# Altium project Pick and place Robot.PrjPcb
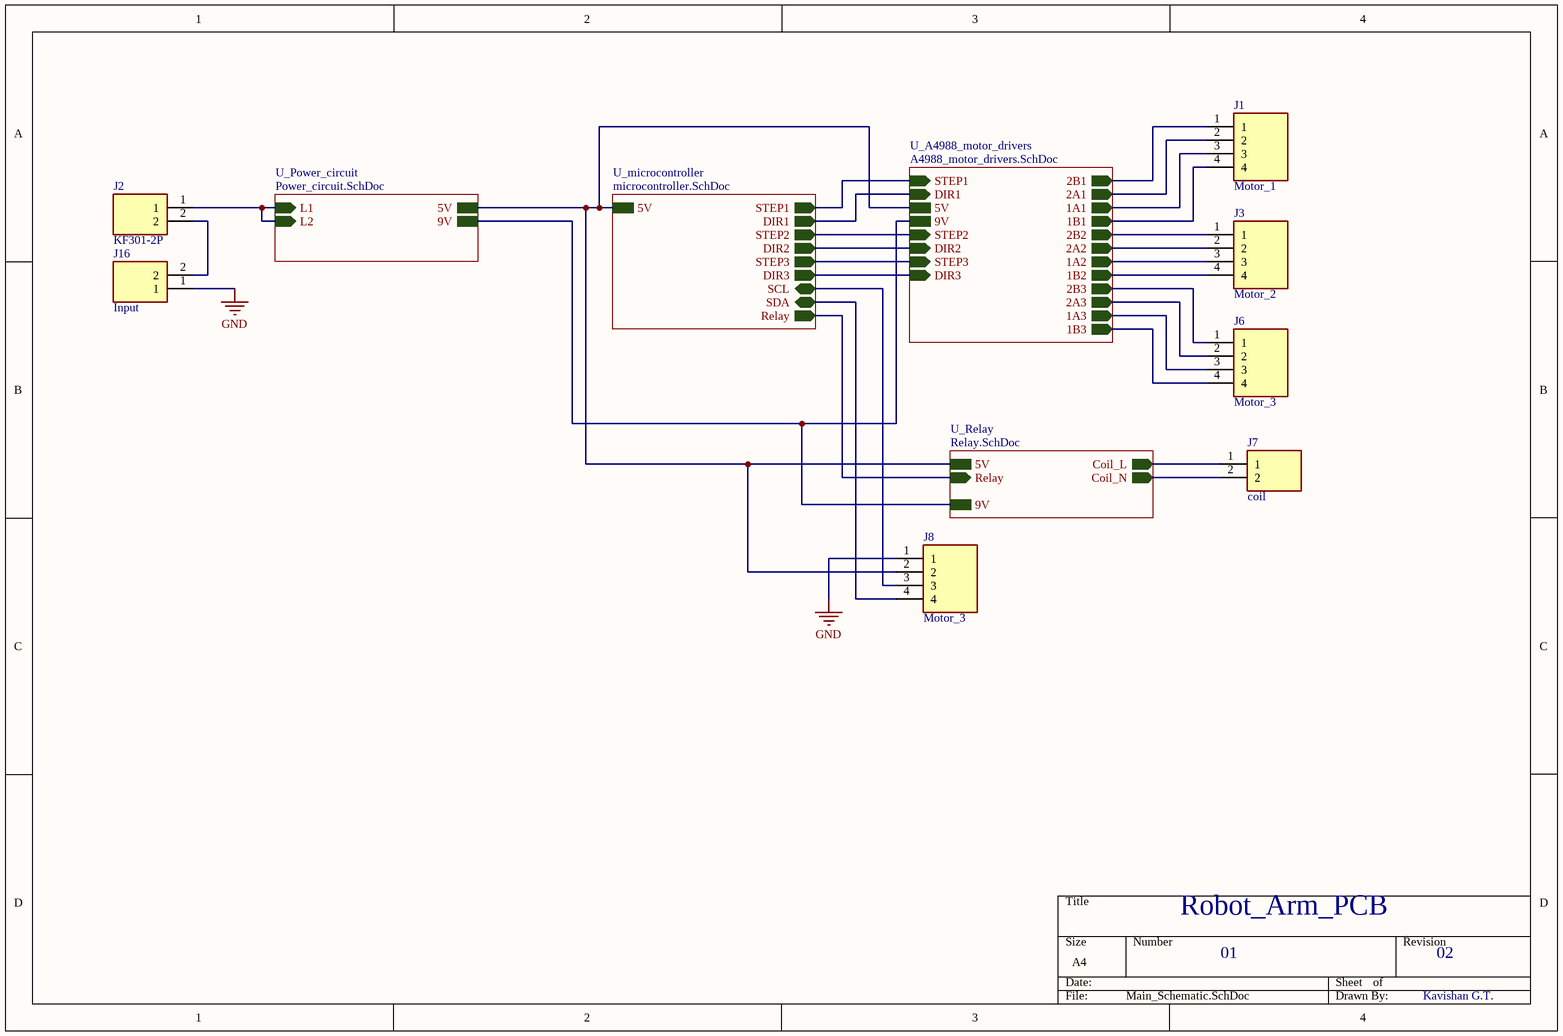
[diagram p0: Main_Schematic.SchDoc]
5 sheets, 45 parts. Net scope: hierarchical (ports join the sheet entries above them; power ports are global).
Board file: Main_pcb.PcbDoc
Sheets:
  Main_Schematic.SchDoc
    U_microcontroller = microcontroller.SchDoc
    U_A4988_motor_drivers = A4988_motor_drivers.SchDoc
    U_Relay = Relay.SchDoc
    U_Power_circuit = Power_circuit.SchDoc

## Sheet Main_Schematic.SchDoc
size A4; SheetNumber: 1; SheetTotal: 5

### Parts
J1  Motor_1  [SHDRRA4W64P0X250_1X4_1240X1150X700P]
J2  KF301-2P  [KF3012P]
J3  Motor_2  [SHDRRA4W64P0X250_1X4_1240X1150X700P]
J6  Motor_3  [SHDRRA4W64P0X250_1X4_1240X1150X700P]
J7  coil  [SHDR2W64P0X250_1X2_750X380X600P]
J8  Motor_3  [SHDRRA4W64P0X250_1X4_1240X1150X700P]
J16  Input  [SHDR2W64P0X250_1X2_750X380X600P]

### Sub-sheets
U_A4988_motor_drivers = A4988_motor_drivers.SchDoc: STEP1 (in), DIR1 (in), 2B1 (out), 2A1 (out), 1A1 (out), 1B1 (out), STEP2 (in), DIR2 (in), 2B2 (out), 2A2 (out), 1A2 (out), 1B2 (out), STEP3 (in), DIR3 (in), 2B3 (out), 2A3 (out), 1A3 (out), 1B3 (out), 5V, 9V
U_microcontroller = microcontroller.SchDoc: 5V, STEP1 (out), DIR1 (out), STEP2 (out), DIR2 (out), STEP3 (out), DIR3 (out), SCL (bidir), SDA (bidir), Relay (out)
U_Power_circuit = Power_circuit.SchDoc: L1 (in), 5V, L2 (in), 9V
U_Relay = Relay.SchDoc: Relay (in), Coil_L (out), Coil_N (out), 5V, 9V

### Nets
5V: J8.2 ; sheet U_microcontroller/5V, sheet U_A4988_motor_drivers/5V, sheet U_Relay/5V, sheet U_Power_circuit/5V
9V: J7.1 ; sheet U_A4988_motor_drivers/9V, sheet U_Relay/Coil_L, sheet U_Relay/9V, sheet U_Power_circuit/9V
GND: J8.1 J16.1
NetC1_1: J2.1 ; sheet U_Power_circuit/L1, sheet U_Power_circuit/L2
NetJ1_1: J1.1 ; sheet U_A4988_motor_drivers/2B1
NetJ1_2: J1.2 ; sheet U_A4988_motor_drivers/2A1
NetJ1_3: J1.3 ; sheet U_A4988_motor_drivers/1A1
NetJ1_4: J1.4 ; sheet U_A4988_motor_drivers/1B1
NetJ2_2: J2.2 J16.2
NetJ3_1: J3.1 ; sheet U_A4988_motor_drivers/2B2
NetJ3_2: J3.2 ; sheet U_A4988_motor_drivers/2A2
NetJ3_3: J3.3 ; sheet U_A4988_motor_drivers/1A2
NetJ3_4: J3.4 ; sheet U_A4988_motor_drivers/1B2
NetJ6_1: J6.1 ; sheet U_A4988_motor_drivers/2B3
NetJ6_2: J6.2 ; sheet U_A4988_motor_drivers/2A3
NetJ6_3: J6.3 ; sheet U_A4988_motor_drivers/1A3
NetJ6_4: J6.4 ; sheet U_A4988_motor_drivers/1B3
NetJ7_2: J7.2 ; sheet U_Relay/Coil_N
NetJ8_3: J8.3 ; sheet U_microcontroller/SCL
NetJ8_4: J8.4 ; sheet U_microcontroller/SDA
NetR3_1: sheet U_microcontroller/Relay, sheet U_Relay/Relay
NetU1_2: sheet U_microcontroller/STEP1, sheet U_A4988_motor_drivers/STEP1
NetU1_3: sheet U_microcontroller/DIR1, sheet U_A4988_motor_drivers/DIR1
NetU1_4: sheet U_microcontroller/STEP2, sheet U_A4988_motor_drivers/STEP2
NetU1_5: sheet U_microcontroller/DIR2, sheet U_A4988_motor_drivers/DIR2
NetU1_6: sheet U_microcontroller/STEP3, sheet U_A4988_motor_drivers/STEP3
NetU1_11: sheet U_microcontroller/DIR3, sheet U_A4988_motor_drivers/DIR3

### Notes on the sheet
- Robot_Arm_PCB
- 01
- 02
- Kavishan G.T.

### Library data of the parts
J1 J3 J6 J8 = S4B-XH-A_LF__SN_: Connector; Manufacturer_Name: JST (JAPAN SOLDERLESS TERMINALS); Manufacturer_Part_Number: S4B-XH-A(LF)(SN); Datasheet Link: http://www.jst-mfg.com/product/pdf/eng/eXH.pdf; Height: 7mm; Arrow Part Number: S4B-XH-A(LF)(SN); Arrow Price/Stock: https://www.arrow.com/en/products/s4b-xh-a-lf-sn/jst-manufacturing?region=europe
J2 = KF301-2P: Connector; Manufacturer_Name: Handson Technology; Datasheet Link: http://www.handsontec.com/dataspecs/terminal%20block-5mm.pdf; Height: 10mm; Manufacturer_Part_Number: KF301-2P
J7 J16 = B2B-EH-A: Connector; Manufacturer_Name: JST (JAPAN SOLDERLESS TERMINALS); Datasheet Link: http://www.jst-mfg.com/product/pdf/eng/eEH.pdf; Height: 6mm; Manufacturer_Part_Number: B2B-EH-A

## Sheet microcontroller.SchDoc
size A4; SheetNumber: 3; SheetTotal: 5
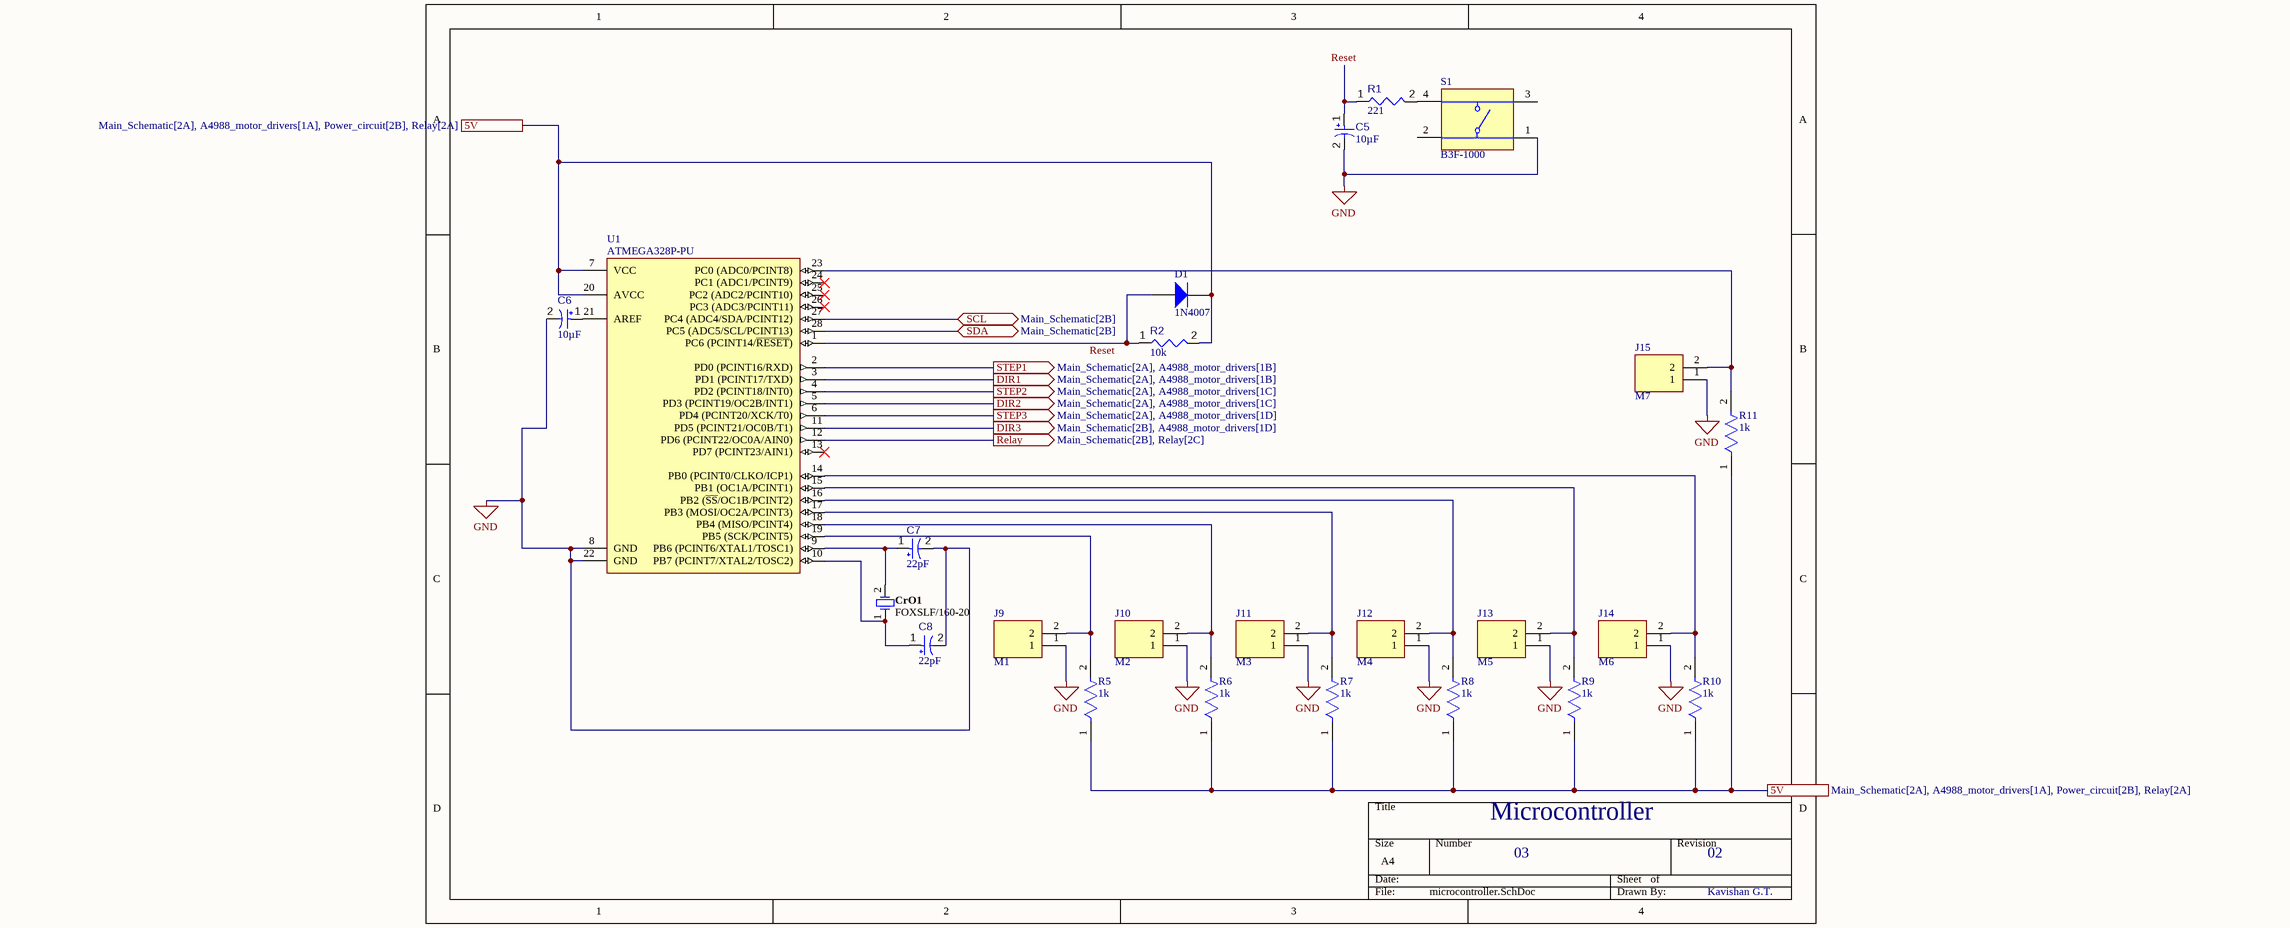
[diagram p1: microcontroller.SchDoc]

### Parts
C5  value 10µF  [CAPPR55-200-1100X500X1200]  (hidden comment: ECA1HM100)
C6  value 10µF  [CAPPR55-200-1100X500X1200]  (hidden comment: ECA1HM100)
C7  value 22pF  [CAPPR55-200-1100X500X1200]  (hidden comment: ECA1HM100)
C8  value 22pF  [CAPPR55-200-1100X500X1200]  (hidden comment: ECA1HM100)
CrO1  FOXSLF/160-20  [FOX-FOXSLF160-20]
D1  1N4007  [FAIR-DO-41-2]
J9  M1  [SHDR2W64P0X250_1X2_750X380X600P]
J10  M2  [SHDR2W64P0X250_1X2_750X380X600P]
J11  M3  [SHDR2W64P0X250_1X2_750X380X600P]
J12  M4  [SHDR2W64P0X250_1X2_750X380X600P]
J13  M5  [SHDR2W64P0X250_1X2_750X380X600P]
J14  M6  [SHDR2W64P0X250_1X2_750X380X600P]
J15  M7  [SHDR2W64P0X250_1X2_750X380X600P]
R1  value 221  [RESA60-630X240]  (hidden comment: MFR-25FBF52-221R)
R2  value 10k  [RESA60-630X240]  (hidden comment: MFR-25FBF52-10K)
R5  1k  [FP-MFR-25-MFG]
R6  1k  [FP-MFR-25-MFG]
R7  1k  [FP-MFR-25-MFG]
R8  1k  [FP-MFR-25-MFG]
R9  1k  [FP-MFR-25-MFG]
R10  1k  [FP-MFR-25-MFG]
R11  1k  [FP-MFR-25-MFG]
S1  B3F-1000  [OMRON-B3F-1000-4_V]
U1  ATMEGA328P-PU  [ATML-28P3]

### Ports
5V (see Main_Schematic[2A], A4988_motor_drivers[1A], Power_circuit[2B], Relay[2A]), DIR1 (out, see Main_Schematic[2A], A4988_motor_drivers[1B]), DIR2 (out, see Main_Schematic[2A], A4988_motor_drivers[1C]), DIR3 (out, see Main_Schematic[2B], A4988_motor_drivers[1D]), Relay (out, see Main_Schematic[2B], Relay[2C]), SCL (bidir, see Main_Schematic[2B]), SDA (bidir, see Main_Schematic[2B]), STEP1 (out, see Main_Schematic[2A], A4988_motor_drivers[1B]), STEP2 (out, see Main_Schematic[2A], A4988_motor_drivers[1C]), STEP3 (out, see Main_Schematic[2A], A4988_motor_drivers[1D])

### Nets
5V: D1.1(K) R2.2 R5.1 R6.1 R7.1 R8.1 R9.1 R10.1 R11.1 U1.7(VCC) U1.20(AVCC) ; port 5V
GND: C5.2 C6.2 C7.2 C8.2 J9.1 J10.1 J11.1 J12.1 J13.1 J14.1 J15.1 S1.1 U1.8(GND) U1.22(GND)
Reset: C5.1 D1.2(A) R1.1 R2.1 U1.1(PC6_(PCINT14/~{RESET}))
NetC6_1: C6.1 U1.21(AREF)
NetC7_1: C7.1 CrO1.2 U1.9(PB6_(PCINT6/XTAL1/TOSC1))
NetC8_1: C8.1 CrO1.1 U1.10(PB7_(PCINT7/XTAL2/TOSC2))
NetJ8_3: U1.27(PC4_(ADC4/SDA/PCINT12)) ; port SCL
NetJ8_4: U1.28(PC5_(ADC5/SCL/PCINT13)) ; port SDA
NetJ9_2: J9.2 R5.2 U1.19(PB5_(SCK/PCINT5))
NetJ10_2: J10.2 R6.2 U1.18(PB4_(MISO/PCINT4))
NetJ11_2: J11.2 R7.2 U1.17(PB3_(MOSI/OC2A/PCINT3))
NetJ12_2: J12.2 R8.2 U1.16(PB2_(~{SS}/OC1B/PCINT2))
NetJ13_2: J13.2 R9.2 U1.15(PB1_(OC1A/PCINT1))
NetJ14_2: J14.2 R10.2 U1.14(PB0_(PCINT0/CLKO/ICP1))
NetJ15_2: J15.2 R11.2 U1.23(PC0_(ADC0/PCINT8))
NetR1_2: R1.2 S1.4
NetR3_1: U1.12(PD6_(PCINT22/OC0A/AIN0)) ; port Relay
NetU1_2: U1.2(PD0_(PCINT16/RXD)) ; port STEP1
NetU1_3: U1.3(PD1_(PCINT17/TXD)) ; port DIR1
NetU1_4: U1.4(PD2_(PCINT18/INT0)) ; port STEP2
NetU1_5: U1.5(PD3_(PCINT19/OC2B/INT1)) ; port DIR2
NetU1_6: U1.6(PD4_(PCINT20/XCK/T0)) ; port STEP3
NetU1_11: U1.11(PD5_(PCINT21/OC0B/T1)) ; port DIR3

Not connected (* = marked no-connect by the designer): S1 2 3; U1 13(PD7_(PCINT23/AIN1))* 24(PC1_(ADC1/PCINT9))* 25(PC2_(ADC2/PCINT10))* 26(PC3_(ADC3/PCINT11))*

### Notes on the sheet
- Microcontroller
- 03
- 02
- Kavishan G.T.

### Library data of the parts
C5-C8 = CMP-001-00025-7: Aluminum Electrolytic Capacitor, 10 uF, +/- 20%, 50 V, -40 to 85 degC, 2-Pin THD, RoHS, Bulk; Manufacturer: Panasonic; Ripple Current (AC): 65mA; Voltage Rating: 50V; Mounting Technology: TH; RoHS Compliant: True; Capacitor Type: Electrolytic; Datasheet Version: Rev. 05, 10/2016; Min Operating Temperature: -40°C; Packaging: Bulk; Ripple Current: 65mA; Tolerance: 20%; Max Operating Temperature: 85°C; Datasheet URL: https://industrial.panasonic.com/cdbs/www-data/pdf/RDF0000/ABA0000C1218.pdf; Lead Pitch: 2mm; Pins: 2; Diameter: 5mm; Manufacturer URL: http://www.panasonic.com/; Package Reference: CAPPR55-200-1100X500X1200; Package Description: 2-Pin Radial Lead, Dia 5 mm, Height 12 mm; Case/Package: Radial; Package Quantity: 200
CrO1 = CMP-1749-00003-1: Resistance Weld Thru-Hole Crystal, 16 MHz, -20 to 70 degC, 2-Pin THD, RoHS, Bulk; Voltage Rating: 250 V; Tolerance: 1%; Resistance: 221 kohm; Case\Package: Axial; Power Rating: 250 mW; RoHSCompliant: true; Package Quantity: 200; Packaging: Bulk; Min Operating Temperature: -55 degC; DatasheetVersion: Mar-15; ComponentLink1URL: http://www.foxonline.com/; Max Operating Temperature: 155 degC; PackageReference: FOXSLF160-20; Mount: Through Hole; PackageDescription: 2-Pin Through Hole Device, Body 11.35 x 4.65 mm; ComponentLink1Description: Manufacturer URL; ComponentLink2URL: http://www.foxonline.com/pdfs/hc49slf.pdf; ComponentLink2Description: Datasheet; Length: 0.248 inch
D1 = CMP-004-00007-2: General Purpose Rectifier, 1.1 V, 1.0 A, -55 to 175 degC, 2-Pin DO-41, RoHS, Tape and Reel; Manufacturer: Fairchild; Peak Reverse Current: 5uA; Max Surge Current: 30A; Elements: 1; Forward Voltage: 1.1V; Package Version: Rev. 2, 09/2008; Forward Current: 1A; Package Quantity: 5000; Packaging: TapeandReel; Package URL: http://www.fairchildsemi.com/dwg/DO/DO41A.pdf; Manufacturer URL: https://www.fairchildsemi.com/; Package Reference: DO-41-2; Pins: 2; Min Operating Temperature: -55°C; Datasheet Version: Rev. 1.1.0, 11/2014; Max Operating Temperature: 175°C; RoHS Compliant: True; Case/Package: DO-41-2; Mounting Technology: TH; Package Description: 2-Pin Axial Lead, Dia 2.375 mm, Body Length 4.63 mm; Datasheet URL: https://www.fairchildsemi.com/datasheets/1N/1N4007.pdf
J9-J15 = B2B-EH-A: as J7 on sheet Main_Schematic; Datasheet Link: http://www.jst-mfg.com/product/pdf/eng/eEH.pdf; Height: 6mm; Manufacturer_Part_Number: B2B-EH-A
R1 = CMP-009-00051-4: Axial Resistor, 221 Ohm, +/- 1%, 250 mW, -55 to 155 degC, 2-Pin THD, RoHS, Bulk; Manufacturer: Yageo; Power: 250mW; Voltage Rating: 250V; Package Quantity: 200; Manufacturer URL: http://www.yageo.com/; Case/Package: Axial; Package Reference: MFR-25; RoHS Compliant: True; Mounting Technology: TH; Datasheet URL: http://www.yageo.com/documents/recent/Yageo%20LR_MFR_2013.pdf; Packaging: Bulk; Package Description: 2-Pin Axial Lead, Dia 2.4 mm, Body Length 6.3 mm; Max Operating Temperature: 155°C; Tolerance: 1%; Datasheet Version: Apr-13; Min Operating Temperature: -55°C
R2 = CMP-009-00047-4: Axial Resistor, 10 KOhm, +/- 1%, 0.25 W, -55 to 155 degC, 2-Pin THD, RoHS, Bulk; Manufacturer: Yageo; Power: 250mW; Voltage Rating: 250V; Manufacturer URL: http://www.yageo.com/; Datasheet URL: http://www.yageo.com/documents/recent/Yageo%20LR_MFR_2013.pdf; Package Reference: MFR-25; Min Operating Temperature: -55°C; Mounting Technology: TH; Package Quantity: 200; Case/Package: Axial; Tolerance: 1%; RoHS Compliant: True; Datasheet Version: Apr-13; Packaging: Bulk; Max Operating Temperature: 155°C; Package Description: 2-Pin Axial Lead, Dia 2.4 mm, Body Length 6.3 mm
R5-R11 = CMP-03413-000001-1: RES 1.18K OHM 1/4W 1% AXIAL; Manufacturer: Yageo; Manufacturer Part Number: MFR-25FBF52-1K18; Value: 1.18kΩ; Temperature Coefficient: 100ppm/°C; Power Rating: 0.25W; Voltage Rating: 250V; Temperature: -55°C to +155°C; Automotive: No; Temperature Range High: +155°C; Mouser Description: Metal Film Resistors 1.18K OHM 1/4W 1%; Digikey Description: RES 1.18K OHM 1/4W 1% AXIAL; Lead Free: Yes; Tolerance: 1%; ComponentLink2Description: Datasheet; ComponentLink2URL: https://www.yageo.com/upload/media/product/products/datasheet/lr/Yageo_LR_MFR_1.pdf; Temperature Range Low: -55°C; Package: MFR-25; Ipc Land Pattern Name: RESAD1000W75L680D260; Composition: Metal Film; Category: Res; Octopart: https://octopart.com/mfr-25fbf52-1k18-yageo-56251681; Series: MFR; Device Class L2: Resistors; Height: 2.6mm; Resistance: 1.18kΩ; Device Class L3: Through-Hole Resistors; RoHS: TRUE; Device Class L1: Passive Components
S1 = CMP-011-00004-2: Tactile Switch, SPST-NO, 0.05 A, 24 V, -25 to 70 degC, 4-Pin THD, RoHS, Bulk; Manufacturer: Omron Electronic Components; Throw Configuration: SPST; Max Contact Resistance: 100mohm; Resistance: 0.1Ohm; Max Current Rating: 50mA; Voltage Rating: 24V; Operating Force: 100gf; Datasheet Version: Jan-15; Case/Package: B3F-1000; Packaging: Bulk; Package Description: 4-Pin Through Hole Device, Body 6 x 6 mm; Manufacturer URL: http://www.omron.com/; Package Reference: B3F-1000; Contact Plating: Gold; Contact Current Rating: 50mA; RoHS Compliant: True; Contact Material: Gold; Mounting Technology: TH; Max Operating Temperature: 70°C; Min Operating Temperature: -25°C; Package Quantity: 1500; Datasheet URL: http://www.omron.com/ecb/products/pdf/en-b3f.pdf; Voltage Rating (DC): 24V; Pins: 4; Current Rating: 50mA; Max Voltage Rating (DC): 24V
U1 = CMP-020-00004-3: 8-Bit Microcontroller with 32 KBytes In-System Programmable Flash, 23 I/Os, -40 to 85 degC, 28-Pin PDIP (28P3), RoHS, Tube; Manufacturer: Atmel; I/Os: 23; Density: 32KB; Package Version: Rev. B, 09/2001; Max Clock Frequency: 20MHz; Interface: USART; Max Supply Voltage: 5.5V; Min Supply Voltage: 1.8V; Ethernet Channels: 0; RAM Size: 2KB; RoHS Compliant: True; Datasheet URL: http://www.atmel.com/images/Atmel-8271-8-bit-AVR-Microcontroller-ATmega48A-48PA-88A-88PA-168A-168PA-328-328P_datasheet_Complete.pdf; Packaging: Rail/Tube; Manufacturer URL: http://www.atmel.com/; Mounting Technology: TH; Package URL: http://www.atmel.com/images/Atmel-8271-8-bit-AVR-Microcontroller-ATmega48A-48PA-88A-88PA-168A-168PA-328-328P_datasheet_Complete.pdf; Datasheet Version: Rev. 8271J, 11/2015; Package Description: 28-Pin Plastic Dual Inline Package, Body 34.671 x 7.3025 mm, Pitch 2.54 mm; Package Quantity: 14; Min Operating Temperature: -40°C; Max Operating Temperature: 85°C; Case/Package: DIP; Pins: 28; Package Reference: 28P3

## Sheet A4988_motor_drivers.SchDoc
size A4; SheetNumber: 4; SheetTotal: 5
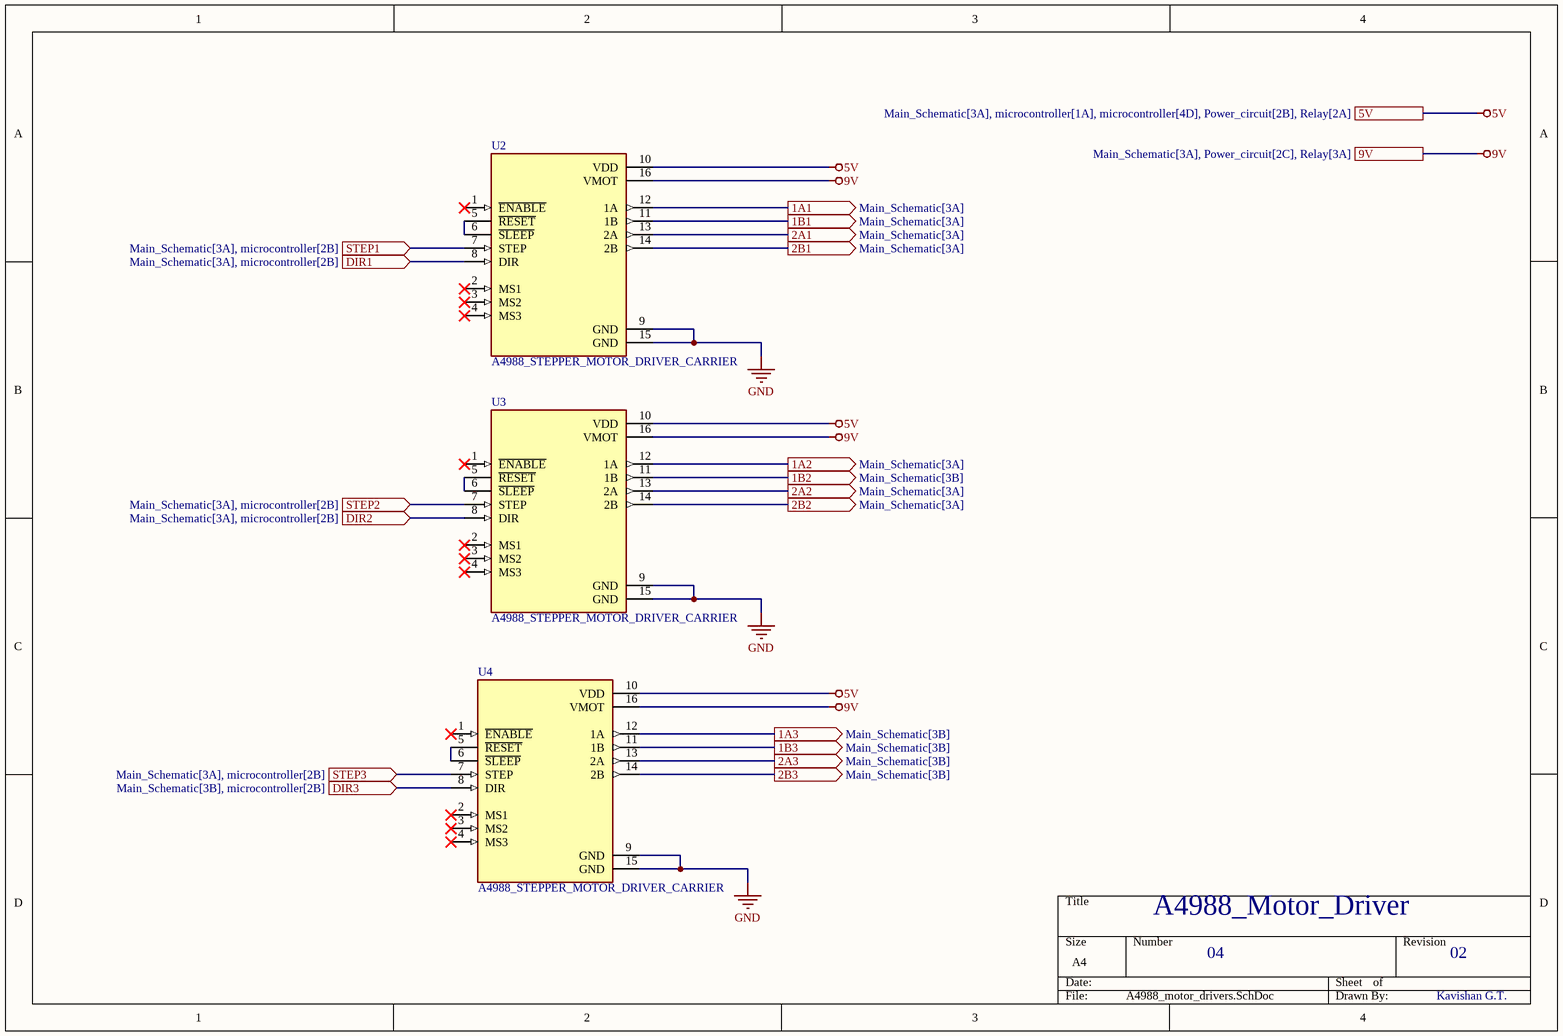
[diagram p2: A4988_motor_drivers.SchDoc]

### Parts
U2  A4988_STEPPER_MOTOR_DRIVER_CARRIER  [MODULE_A4988_STEPPER_MOTOR_DRIVER_CARRIER]
U3  A4988_STEPPER_MOTOR_DRIVER_CARRIER  [MODULE_A4988_STEPPER_MOTOR_DRIVER_CARRIER]
U4  A4988_STEPPER_MOTOR_DRIVER_CARRIER  [MODULE_A4988_STEPPER_MOTOR_DRIVER_CARRIER]

### Ports
1A1 (out, see Main_Schematic[3A]), 1A2 (out, see Main_Schematic[3A]), 1A3 (out, see Main_Schematic[3B]), 1B1 (out, see Main_Schematic[3A]), 1B2 (out, see Main_Schematic[3B]), 1B3 (out, see Main_Schematic[3B]), 2A1 (out, see Main_Schematic[3A]), 2A2 (out, see Main_Schematic[3A]), 2A3 (out, see Main_Schematic[3B]), 2B1 (out, see Main_Schematic[3A]), 2B2 (out, see Main_Schematic[3A]), 2B3 (out, see Main_Schematic[3B]), 5V (see Main_Schematic[3A], microcontroller[1A], microcontroller[4D], Power_circuit[2B], Relay[2A]), 9V (see Main_Schematic[3A], Power_circuit[2C], Relay[3A]), DIR1 (in, see Main_Schematic[3A], microcontroller[2B]), DIR2 (in, see Main_Schematic[3A], microcontroller[2B]), DIR3 (in, see Main_Schematic[3B], microcontroller[2B]), STEP1 (in, see Main_Schematic[3A], microcontroller[2B]), STEP2 (in, see Main_Schematic[3A], microcontroller[2B]), STEP3 (in, see Main_Schematic[3A], microcontroller[2B])

### Nets
5V: U2.10(VDD) U3.10(VDD) U4.10(VDD) ; port 5V
9V: U2.16(VMOT) U3.16(VMOT) U4.16(VMOT) ; port 9V
GND: U2.9(GND) U2.15(GND) U3.9(GND) U3.15(GND) U4.9(GND) U4.15(GND)
NetJ1_1: U2.14(2B) ; port 2B1
NetJ1_2: U2.13(2A) ; port 2A1
NetJ1_3: U2.12(1A) ; port 1A1
NetJ1_4: U2.11(1B) ; port 1B1
NetJ3_1: U3.14(2B) ; port 2B2
NetJ3_2: U3.13(2A) ; port 2A2
NetJ3_3: U3.12(1A) ; port 1A2
NetJ3_4: U3.11(1B) ; port 1B2
NetJ6_1: U4.14(2B) ; port 2B3
NetJ6_2: U4.13(2A) ; port 2A3
NetJ6_3: U4.12(1A) ; port 1A3
NetJ6_4: U4.11(1B) ; port 1B3
NetU1_2: U2.7(STEP) ; port STEP1
NetU1_3: U2.8(DIR) ; port DIR1
NetU1_4: U3.7(STEP) ; port STEP2
NetU1_5: U3.8(DIR) ; port DIR2
NetU1_6: U4.7(STEP) ; port STEP3
NetU1_11: U4.8(DIR) ; port DIR3
NetU2_5: U2.5(~{RESET}) U2.6(~{SLEEP})
NetU3_5: U3.5(~{RESET}) U3.6(~{SLEEP})
NetU4_5: U4.5(~{RESET}) U4.6(~{SLEEP})

Not connected (* = marked no-connect by the designer): U2 1(~{ENABLE})* 2(MS1)* 3(MS2)* 4(MS3)*; U3 1(~{ENABLE})* 2(MS1)* 3(MS2)* 4(MS3)*; U4 1(~{ENABLE})* 2(MS1)* 3(MS2)* 4(MS3)*

### Notes on the sheet
- A4988_Motor_Driver
- 04
- 02
- Kavishan G.T.

### Library data of the parts
U2-U4 = A4988_STEPPER_MOTOR_DRIVER_CARRIER: Stepper motor controler; IC: A4988; 1A; Uin mot: 8Ã·35V; Price: None; Value: *; MP: A4988_STEPPER_MOTOR_DRIVER_CARRIER; Package: None; Availability: Unavailable

## Sheet Relay.SchDoc
size A4; SheetNumber: 5; SheetTotal: 5
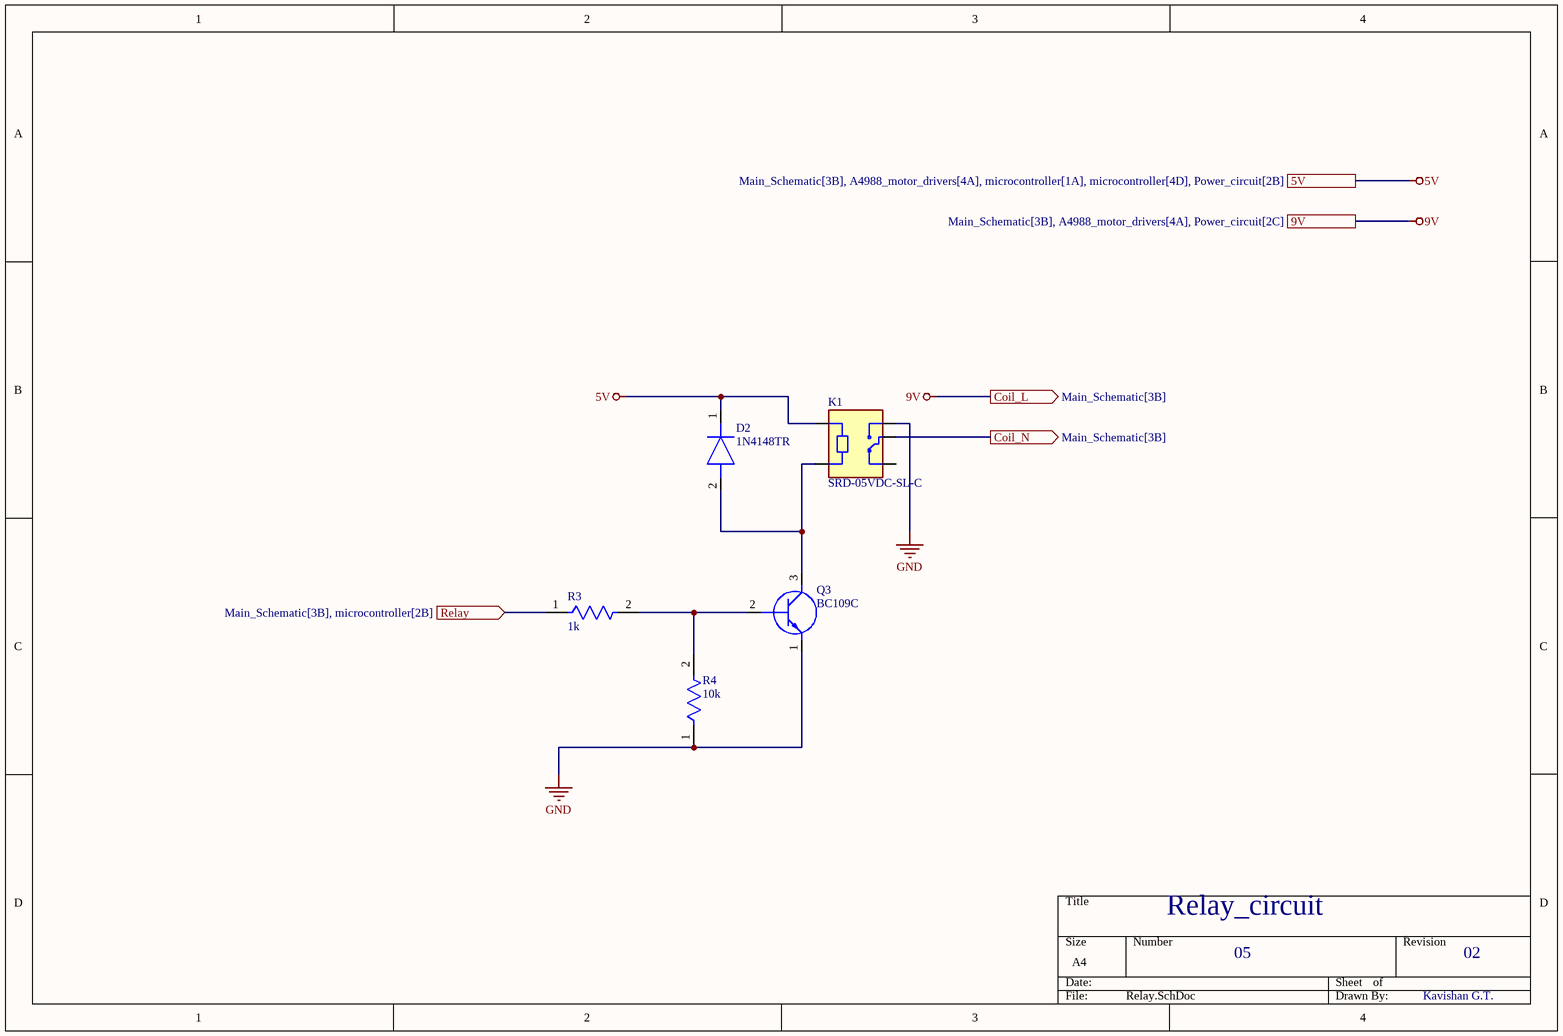
[diagram p3: Relay.SchDoc]

### Parts
D2  1N4148TR  [DIOAD990W55L340D162]
K1  SRD-05VDC-SL-C  [RELAY_SRD-05VDC-SL-C]
Q3  BC109C  [CENTRAL_TO18]
R3  1k  [FP-MFR-25-MFG]
R4  10k  [FP-MFR-25-MFG]

### Ports
5V (see Main_Schematic[3B], A4988_motor_drivers[4A], microcontroller[1A], microcontroller[4D], Power_circuit[2B]), 9V (see Main_Schematic[3B], A4988_motor_drivers[4A], Power_circuit[2C]), Coil_L (out, see Main_Schematic[3B]), Coil_N (out, see Main_Schematic[3B]), Relay (in, see Main_Schematic[3B], microcontroller[2B])

### Nets
5V: D2.1(K) K1.A1 ; port 5V
9V: port Coil_L, port 9V
GND: K1.NO Q3.1(E) R4.1
NetD2_2: D2.2(A) K1.A2 Q3.3(C)
NetJ7_2: K1.COM ; port Coil_N
NetQ3_2: Q3.2(B) R3.2 R4.2
NetR3_1: R3.1 ; port Relay

Not connected (* = marked no-connect by the designer): K1 NC

### Notes on the sheet
- Relay_circuit
- 05
- 02
- Kavishan G.T.

### Library data of the parts
D2 = 1N4148TR: Diode; Manufacturer_Name: Vishay; Datasheet Link: https://www.vishay.com/docs/81857/1n4148.pdf; Manufacturer_Part_Number: 1N4148TR; Mouser Part Number: 78-1N4148; Mouser Price/Stock: https://www.mouser.co.uk/ProductDetail/Vishay-Semiconductors/1N4148TR?qs=HfDODkYFUverVKi%2FJ%2Fe5IA%3D%3D; Arrow Part Number: 1N4148TR; Arrow Price/Stock: https://www.arrow.com/en/products/1n4148tr/vishay?region=nac
K1 = SRD-05VDC-SL-C: 5V Trigger Relay Module For Arduino And Raspberry Pi 5V Trigger Relay Module For Arduino And Raspberry Pi; MF: Songle Relay; Check_prices: https://www.snapeda.com/parts/SRD-05VDC-SL-C/Songle+Relay/view-part/?ref=eda; Value: *; Availability: Not in stock; Price: None; Package: NON STANDARD-5 Songle Relay; MP: SRD-05VDC-SL-C; SnapEDA_Link: https://www.snapeda.com/parts/SRD-05VDC-SL-C/Songle+Relay/view-part/?ref=snap
Q3 = BC109C: Transistor BJT NPN; Manufacturer_Name: Central Semiconductor; Datasheet Link: https://my.centralsemi.com/get_document.php?cmp=1&mergetype=pd&mergepath=pd&pdf_id=BC107.PDF; Manufacturer_Part_Number: BC109C; Mouser Part Number: 610-BC109C; Mouser Price/Stock: https://www.mouser.com/Search/Refine.aspx?Keyword=610-BC109C
R3 R4 = CMP-03413-000001-1: as R5 on sheet microcontroller; Temperature: -55°C to +155°C; Automotive: No; Temperature Range High: +155°C; Mouser Description: Metal Film Resistors 1.18K OHM 1/4W 1%; Digikey Description: RES 1.18K OHM 1/4W 1% AXIAL; Lead Free: Yes; Tolerance: 1%; ComponentLink2Description: Datasheet; ComponentLink2URL: https://www.yageo.com/upload/media/product/products/datasheet/lr/Yageo_LR_MFR_1.pdf; Temperature Range Low: -55°C; Package: MFR-25; Ipc Land Pattern Name: RESAD1000W75L680D260; Composition: Metal Film; Category: Res; Octopart: https://octopart.com/mfr-25fbf52-1k18-yageo-56251681; Series: MFR; Device Class L2: Resistors; Height: 2.6mm; Resistance: 1.18kΩ; Device Class L3: Through-Hole Resistors; RoHS: TRUE; Device Class L1: Passive Components

## Sheet Power_circuit.SchDoc
size A4; SheetNumber: 2; SheetTotal: 5
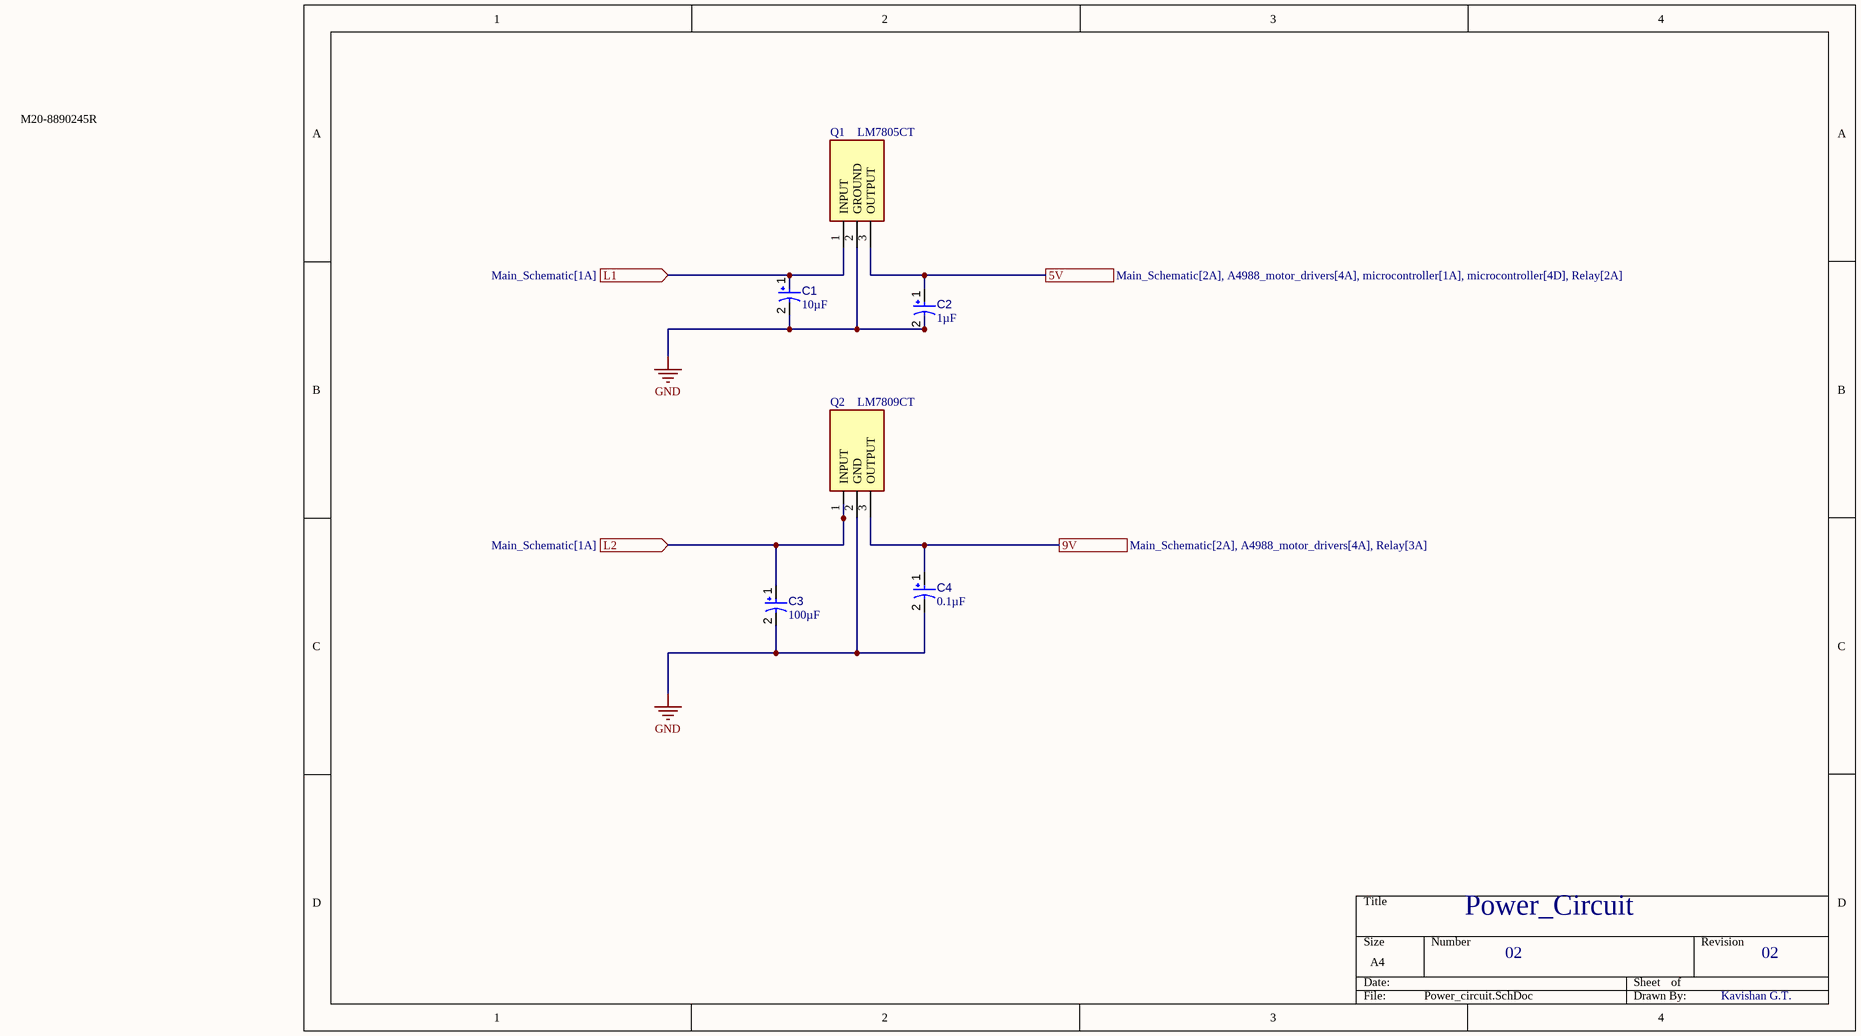
[diagram p4: Power_circuit.SchDoc]

### Parts
C1  value 10µF  [CAPPR55-200-1100X500X1200]  (hidden comment: ECA1HM100)
C2  value 1µF  [CAPPR55-200-1100X500X1200]  (hidden comment: ECA1HM100)
C3  value 100µF  [CAPPR55-200-1100X500X1200]  (hidden comment: ECA1HM100)
C4  value 0.1µF  [CAPPR55-200-1100X500X1200]  (hidden comment: ECA1HM100)
Q1  LM7805CT  [TO254P470X1028X1955-3P]
Q2  LM7809CT  [TO254P470X1016X2019-3P]

### Ports
5V (see Main_Schematic[2A], A4988_motor_drivers[4A], microcontroller[1A], microcontroller[4D], Relay[2A]), 9V (see Main_Schematic[2A], A4988_motor_drivers[4A], Relay[3A]), L1 (in, see Main_Schematic[1A]), L2 (in, see Main_Schematic[1A])

### Nets
5V: C2.1 Q1.3(OUTPUT) ; port 5V
9V: C4.1 Q2.3(OUTPUT) ; port 9V
GND: C1.2 C2.2 C3.2 C4.2 Q1.2(GROUND) Q2.2(GND)
NetC1_1: C1.1 C3.1 Q1.1(INPUT) Q2.1(INPUT) ; port L1, port L2

### Notes on the sheet
- M20-8890245R
- Power_Circuit
- 02
- Kavishan G.T.

### Library data of the parts
C1-C4 = CMP-001-00025-7: as C5 on sheet microcontroller; Mounting Technology: TH; RoHS Compliant: True; Capacitor Type: Electrolytic; Datasheet Version: Rev. 05, 10/2016; Min Operating Temperature: -40°C; Packaging: Bulk; Ripple Current: 65mA; Tolerance: 20%; Max Operating Temperature: 85°C; Datasheet URL: https://industrial.panasonic.com/cdbs/www-data/pdf/RDF0000/ABA0000C1218.pdf; Lead Pitch: 2mm; Pins: 2; Diameter: 5mm; Manufacturer URL: http://www.panasonic.com/; Package Reference: CAPPR55-200-1100X500X1200; Package Description: 2-Pin Radial Lead, Dia 5 mm, Height 12 mm; Case/Package: Radial; Package Quantity: 200
Q1 = LM7805CT: Integrated Circuit; Manufacturer_Name: Texas Instruments; Datasheet Link: http://www.ti.com/lit/ds/symlink/lm340.pdf; Height: 4.7mm; Manufacturer_Part_Number: LM7805CT; Mouser Part Number: 926-LM7805CT; Mouser Price/Stock: https://www.mouser.co.uk/ProductDetail/Texas-Instruments/LM7805CT?qs=QbsRYf82W3EaqXeMDVwIfQ%3D%3D; Arrow Part Number: LM7805CT; Arrow Price/Stock: https://www.arrow.com/en/products/lm7805ct/texas-instruments?region=europe
Q2 = LM7809CT: Power Supply; Manufacturer_Name: onsemi; Datasheet Link: https://mouser.componentsearchengine.com/Datasheets/2/LM7809CT.pdf; Height: 4.7mm; Manufacturer_Part_Number: LM7809CT; Mouser Part Number: 512-LM7809CT; Mouser Price/Stock: https://www.mouser.co.uk/ProductDetail/ON-Semiconductor-Fairchild/LM7809CT?qs=VOMQJJE%252BBNmmTueoZonUjQ%3D%3D; Arrow Part Number: LM7809CT; Arrow Price/Stock: https://www.arrow.com/en/products/lm7809ct/on-semiconductor?region=europe

## Nets that join several sheets
5V: Main_Schematic (J8.2), microcontroller (11 pins), A4988_motor_drivers (U2.10 U3.10 U4.10), Relay (D2.1 K1.A1), Power_circuit (C2.1 Q1.3)
9V: Main_Schematic (J7.1), A4988_motor_drivers (U2.16 U3.16 U4.16), Power_circuit (C4.1 Q2.3)
GND: Main_Schematic (J8.1 J16.1), microcontroller (14 pins), A4988_motor_drivers (6 pins), Relay (K1.NO Q3.1 R4.1), Power_circuit (6 pins)
NetC1_1: Main_Schematic (J2.1), Power_circuit (C1.1 C3.1 Q1.1 Q2.1)
NetJ1_1: Main_Schematic (J1.1), A4988_motor_drivers (U2.14)
NetJ1_2: Main_Schematic (J1.2), A4988_motor_drivers (U2.13)
NetJ1_3: Main_Schematic (J1.3), A4988_motor_drivers (U2.12)
NetJ1_4: Main_Schematic (J1.4), A4988_motor_drivers (U2.11)
NetJ3_1: Main_Schematic (J3.1), A4988_motor_drivers (U3.14)
NetJ3_2: Main_Schematic (J3.2), A4988_motor_drivers (U3.13)
NetJ3_3: Main_Schematic (J3.3), A4988_motor_drivers (U3.12)
NetJ3_4: Main_Schematic (J3.4), A4988_motor_drivers (U3.11)
NetJ6_1: Main_Schematic (J6.1), A4988_motor_drivers (U4.14)
NetJ6_2: Main_Schematic (J6.2), A4988_motor_drivers (U4.13)
NetJ6_3: Main_Schematic (J6.3), A4988_motor_drivers (U4.12)
NetJ6_4: Main_Schematic (J6.4), A4988_motor_drivers (U4.11)
NetJ7_2: Main_Schematic (J7.2), Relay (K1.COM)
NetJ8_3: Main_Schematic (J8.3), microcontroller (U1.27)
NetJ8_4: Main_Schematic (J8.4), microcontroller (U1.28)
NetR3_1: microcontroller (U1.12), Relay (R3.1)
NetU1_2: microcontroller (U1.2), A4988_motor_drivers (U2.7)
NetU1_3: microcontroller (U1.3), A4988_motor_drivers (U2.8)
NetU1_4: microcontroller (U1.4), A4988_motor_drivers (U3.7)
NetU1_5: microcontroller (U1.5), A4988_motor_drivers (U3.8)
NetU1_6: microcontroller (U1.6), A4988_motor_drivers (U4.7)
NetU1_11: microcontroller (U1.11), A4988_motor_drivers (U4.8)